# EAGLE design LEGOduino (EAGLE 9.5.2)

## Sheet 1 of 2
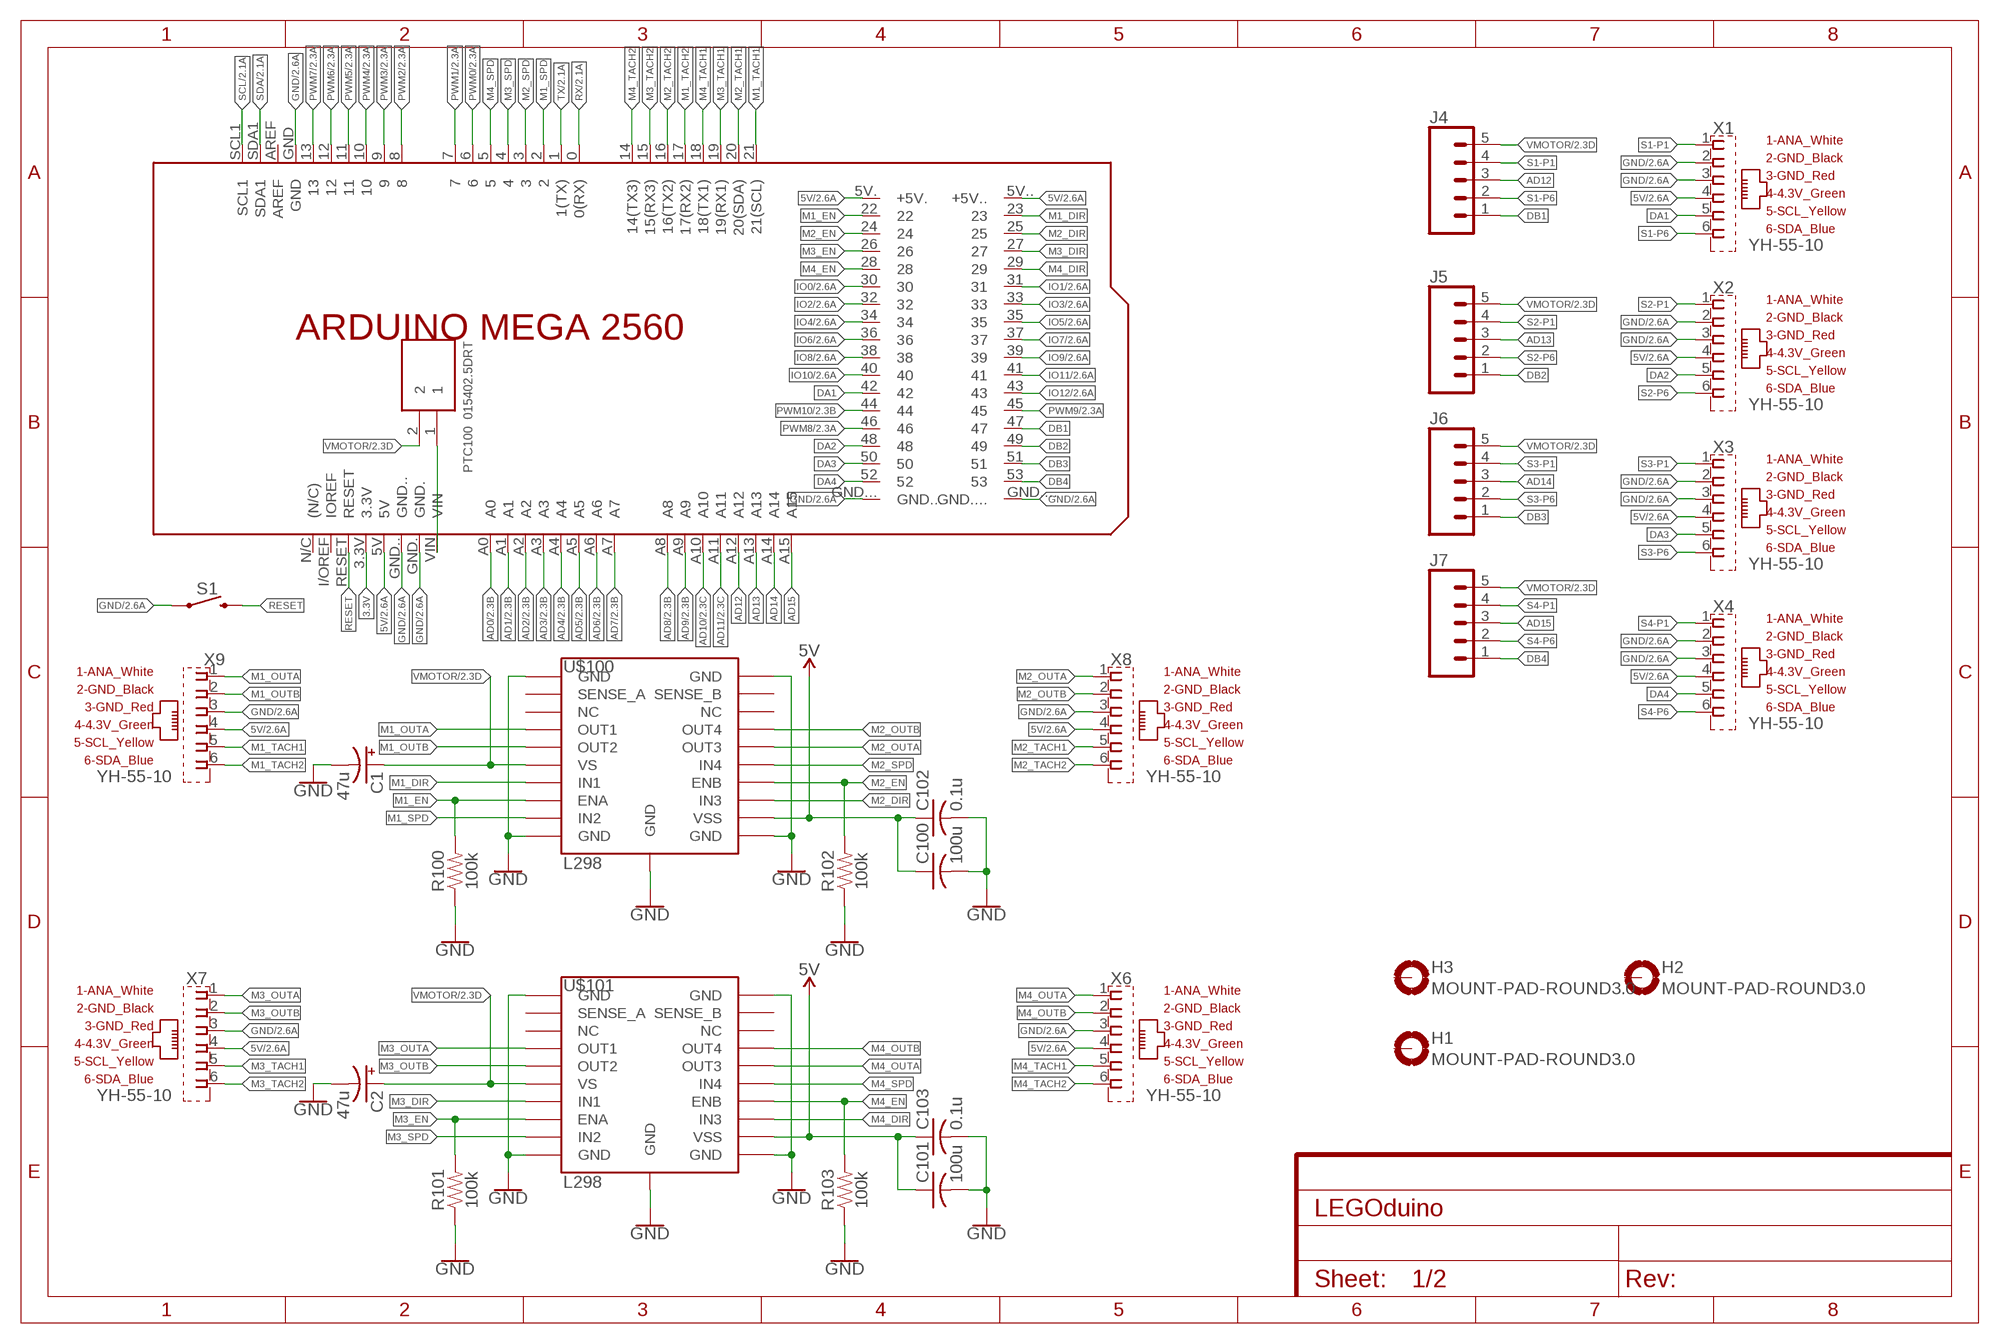
[diagram p0: schematic, sheet 1]

### Parts
C1  47u  C-POL-US_ECAP-8.5MM  [CAPAE830X1050N]
C2  47u  C-POL-US_ECAP-8.5MM  [CAPAE830X1050N]
C100  100u  C-USC0805K  [C0805K]
C101  100u  C-USC0805K  [C0805K]
C102  0.1u  C-USC0805K  [C0805K]
C103  0.1u  C-USC0805K  [C0805K]
H1  MOUNT-PAD-ROUND3.0  [3,0-PAD]
H2  MOUNT-PAD-ROUND3.0  [3,0-PAD]
H3  MOUNT-PAD-ROUND3.0  [3,0-PAD]
J4  CONN_05  [1X05]
J5  CONN_05  [1X05]
J6  CONN_05  [1X05]
J7  CONN_05  [1X05]
PCB100  ARDUINO_MEGA2560  [ARDUINO_MEGA2560]
PTC100  015402.5DRT  [FUSM9750X381N]
R100  100k  RESISTOR0805  [0805]
R101  100k  RESISTOR0805  [0805]
R102  100k  RESISTOR0805  [0805]
R103  100k  RESISTOR0805  [0805]
S1  MOMENTARY-SWITCH-SPST-SMD-5.2MM  [TACTILE_SWITCH_SMD_5.2MM]
U$100  L298  L298_SMD_W_PAD  [POWERSO20_L298_PAD]
U$101  L298  L298_SMD_W_PAD  [POWERSO20_L298_PAD]
X1  YH-55-10  [YH-55-10]
X2  YH-55-10  [YH-55-10]
X3  YH-55-10  [YH-55-10]
X4  YH-55-10  [YH-55-10]
X6  YH-55-10  [YH-55-10]
X7  YH-55-10  [YH-55-10]
X8  YH-55-10  [YH-55-10]
X9  YH-55-10  [YH-55-10]

### Nets
3.3V: PCB100.3.3V
5V: C100.1 C101.1 C102.1 C103.1 PCB100.5V PCB100.5V.(+5V.) PCB100.5V..(+5V..) U$100.12(VSS) U$101.12(VSS) X1.4(4_4.3V_GREEN) X2.4(4_4.3V_GREEN) X3.4(4_4.3V_GREEN) X4.4(4_4.3V_GREEN) X6.4(4_4.3V_GREEN) X7.4(4_4.3V_GREEN) X8.4(4_4.3V_GREEN) X9.4(4_4.3V_GREEN) ; also sheet 2
AD0: PCB100.A0 ; also sheet 2
AD1: PCB100.A1 ; also sheet 2
AD2: PCB100.A2 ; also sheet 2
AD3: PCB100.A3 ; also sheet 2
AD4: PCB100.A4 ; also sheet 2
AD5: PCB100.A5 ; also sheet 2
AD6: PCB100.A6 ; also sheet 2
AD7: PCB100.A7 ; also sheet 2
AD8: PCB100.A8 ; also sheet 2
AD9: PCB100.A9 ; also sheet 2
AD10: PCB100.A10 ; also sheet 2
AD11: PCB100.A11 ; also sheet 2
AD12: J4.3 PCB100.A12
AD13: J5.3 PCB100.A13
AD14: J6.3 PCB100.A14
AD15: J7.3 PCB100.A15
DA1: PCB100.42 X1.5(5_SCL_YELLOW)
DA2: PCB100.48 X2.5(5_SCL_YELLOW)
DA3: PCB100.50 X3.5(5_SCL_YELLOW)
DA4: PCB100.52 X4.5(5_SCL_YELLOW)
DB1: J4.1 PCB100.47
DB2: J5.1 PCB100.49
DB3: J6.1 PCB100.51
DB4: J7.1 PCB100.53
GND: C1.2(-) C2.2(-) C100.2 C101.2 C102.2 C103.2 PCB100.GND PCB100.GND. PCB100.GND.. PCB100.GND... PCB100.GND.... R100.1 R101.1 R102.1 R103.1 S1.1 U$100.1(GND) U$100.10(GND) U$100.11(GND) U$100.20(GND) U$100.PAD(GND) U$101.1(GND) U$101.10(GND) U$101.11(GND) U$101.20(GND) U$101.PAD(GND) X1.2(2_GND_BLACK) X1.3(3_GND_RED) X2.2(2_GND_BLACK) X2.3(3_GND_RED) X3.2(2_GND_BLACK) X3.3(3_GND_RED) X4.2(2_GND_BLACK) X4.3(3_GND_RED) X6.3(3_GND_RED) X7.3(3_GND_RED) X8.3(3_GND_RED) X9.3(3_GND_RED) ; also sheet 2
IO0: PCB100.30 ; also sheet 2
IO1: PCB100.31 ; also sheet 2
IO2: PCB100.32 ; also sheet 2
IO3: PCB100.33 ; also sheet 2
IO4: PCB100.34 ; also sheet 2
IO5: PCB100.35 ; also sheet 2
IO6: PCB100.36 ; also sheet 2
IO7: PCB100.37 ; also sheet 2
IO8: PCB100.38 ; also sheet 2
IO9: PCB100.39 ; also sheet 2
IO10: PCB100.40 ; also sheet 2
IO11: PCB100.41 ; also sheet 2
IO12: PCB100.43 ; also sheet 2
M1_DIR: PCB100.23 U$100.7(IN1)
M1_EN: PCB100.22 R100.2 U$100.8(ENA)
M1_OUTA: U$100.4(OUT1) X9.1(1_ANA_WHITE)
M1_OUTB: U$100.5(OUT2) X9.2(2_GND_BLACK)
M1_SPD: PCB100.2 U$100.9(IN2)
M1_TACH1: PCB100.21(21(SCL)) X9.5(5_SCL_YELLOW)
M1_TACH2: PCB100.17(17(RX2)) X9.6(6_SDA_BLUE)
M2_DIR: PCB100.25 U$100.13(IN3)
M2_EN: PCB100.24 R102.2 U$100.14(ENB)
M2_OUTA: U$100.16(OUT3) X8.1(1_ANA_WHITE)
M2_OUTB: U$100.17(OUT4) X8.2(2_GND_BLACK)
M2_SPD: PCB100.3 U$100.15(IN4)
M2_TACH1: PCB100.20(20(SDA)) X8.5(5_SCL_YELLOW)
M2_TACH2: PCB100.16(16(TX2)) X8.6(6_SDA_BLUE)
M3_DIR: PCB100.27 U$101.7(IN1)
M3_EN: PCB100.26 R101.2 U$101.8(ENA)
M3_OUTA: U$101.4(OUT1) X7.1(1_ANA_WHITE)
M3_OUTB: U$101.5(OUT2) X7.2(2_GND_BLACK)
M3_SPD: PCB100.4 U$101.9(IN2)
M3_TACH1: PCB100.19(19(RX1)) X7.5(5_SCL_YELLOW)
M3_TACH2: PCB100.15(15(RX3)) X7.6(6_SDA_BLUE)
M4_DIR: PCB100.29 U$101.13(IN3)
M4_EN: PCB100.28 R103.2 U$101.14(ENB)
M4_OUTA: U$101.16(OUT3) X6.1(1_ANA_WHITE)
M4_OUTB: U$101.17(OUT4) X6.2(2_GND_BLACK)
M4_SPD: PCB100.5 U$101.15(IN4)
M4_TACH1: PCB100.18(18(TX1)) X6.5(5_SCL_YELLOW)
M4_TACH2: PCB100.14(14(TX3)) X6.6(6_SDA_BLUE)
N$19: PCB100.VIN PTC100.1
PWM0: PCB100.6 ; also sheet 2
PWM1: PCB100.7 ; also sheet 2
PWM2: PCB100.8 ; also sheet 2
PWM3: PCB100.9 ; also sheet 2
PWM4: PCB100.10 ; also sheet 2
PWM5: PCB100.11 ; also sheet 2
PWM6: PCB100.12 ; also sheet 2
PWM7: PCB100.13 ; also sheet 2
PWM8: PCB100.46 ; also sheet 2
PWM9: PCB100.45 ; also sheet 2
PWM10: PCB100.44 ; also sheet 2
RESET: PCB100.RESET S1.3
RX: PCB100.0(0(RX)) ; also sheet 2
S1-P1: J4.4 X1.1(1_ANA_WHITE)
S1-P6: J4.2 X1.6(6_SDA_BLUE)
S2-P1: J5.4 X2.1(1_ANA_WHITE)
S2-P6: J5.2 X2.6(6_SDA_BLUE)
S3-P1: J6.4 X3.1(1_ANA_WHITE)
S3-P6: J6.2 X3.6(6_SDA_BLUE)
S4-P1: J7.4 X4.1(1_ANA_WHITE)
S4-P6: J7.2 X4.6(6_SDA_BLUE)
SCL: PCB100.SCL1 ; also sheet 2
SDA: PCB100.SDA1 ; also sheet 2
TX: PCB100.1(1(TX)) ; also sheet 2
VMOTOR: C1.1(+) C2.1(+) J4.5 J5.5 J6.5 J7.5 PTC100.2 U$100.6(VS) U$101.6(VS) ; also sheet 2
Unconnected: H1.B3,0(MOUNT) H2.B3,0(MOUNT) H3.B3,0(MOUNT) PCB100.AREF PCB100.I/OREF(IOREF) PCB100.N/C((N/C)) U$100.2(SENSE_A) U$100.3(NC) U$100.18(NC) U$100.19(SENSE_B) U$101.2(SENSE_A) U$101.3(NC) U$101.18(NC) U$101.19(SENSE_B)

## Sheet 2 of 2
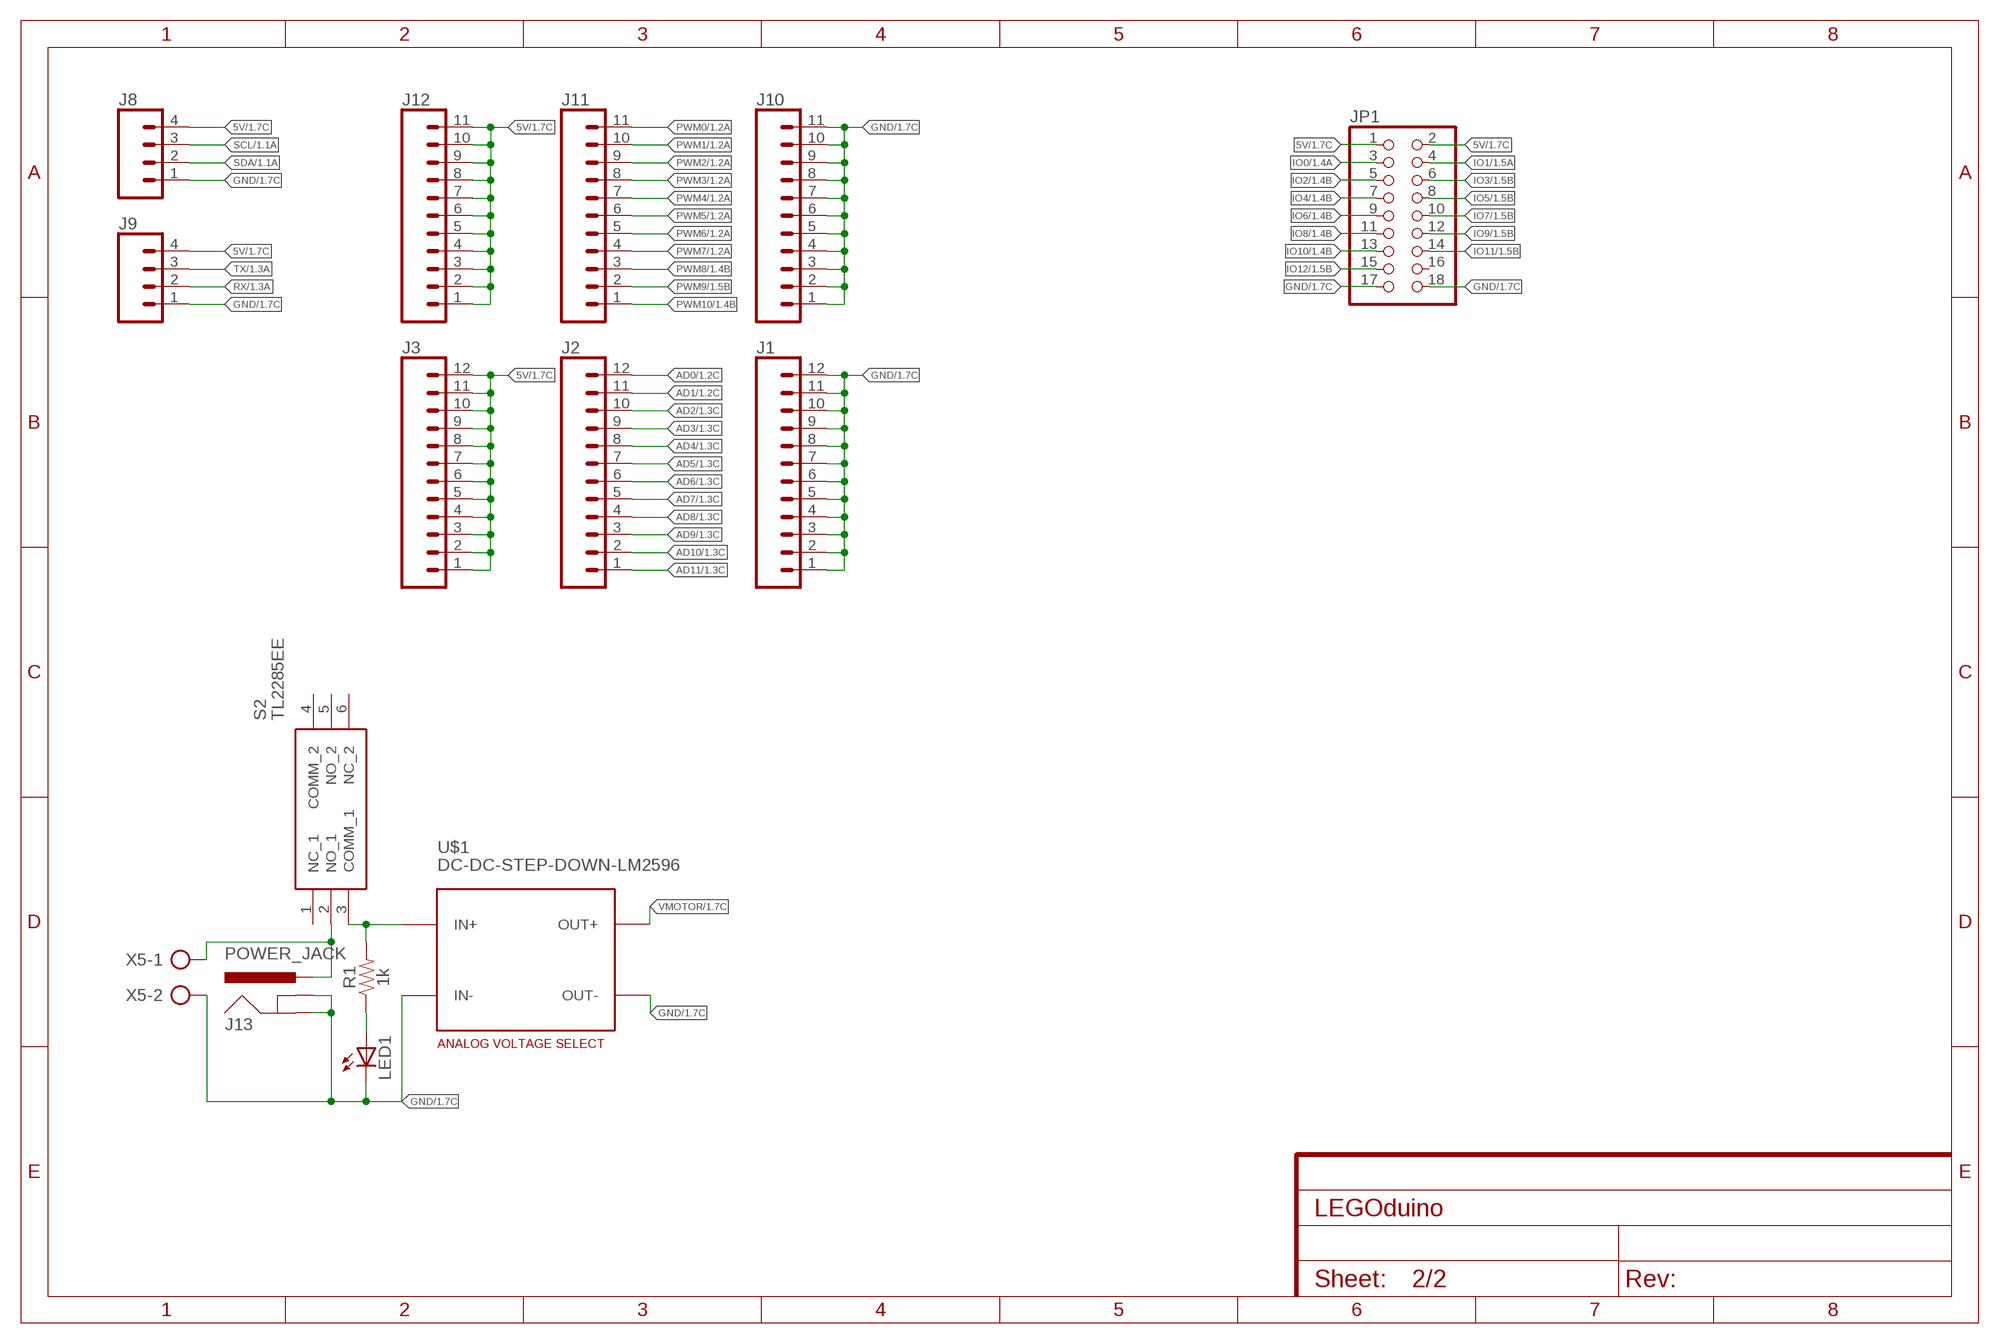
[diagram p1: schematic, sheet 2]

### Parts
J1  CONN_12  [1X12]
J2  CONN_12  [1X12]
J3  CONN_12  [1X12]
J8  CONN_04  [1X04]
J9  CONN_04  [1X04]
J10  CONN_11  [1X11]
J11  CONN_11  [1X11]
J12  CONN_11  [1X11]
J13  POWER_JACK  [POWER_JACK_PTH]
JP1  PINHD-2X9  [2X09]
LED1  LEDCHIP-LED0805  [CHIP-LED0805]
R1  1k  RESISTOR0805  [0805]
S2  TL2285EE  [TL2285EE]
U$1  DC-DC-STEP-DOWN-LM2596  [DC-DC-STEP-DOWN-LM2596]
X5  AK500/2-H  [AK500/2-H]

### Nets
5V: J3.1 J3.2 J3.3 J3.4 J3.5 J3.6 J3.7 J3.8 J3.9 J3.10 J3.11 J3.12 J8.4 J9.4 J12.1 J12.2 J12.3 J12.4 J12.5 J12.6 J12.7 J12.8 J12.9 J12.10 J12.11 JP1.1 JP1.2 ; also sheet 1
AD0: J2.12 ; also sheet 1
AD1: J2.11 ; also sheet 1
AD2: J2.10 ; also sheet 1
AD3: J2.9 ; also sheet 1
AD4: J2.8 ; also sheet 1
AD5: J2.7 ; also sheet 1
AD6: J2.6 ; also sheet 1
AD7: J2.5 ; also sheet 1
AD8: J2.4 ; also sheet 1
AD9: J2.3 ; also sheet 1
AD10: J2.2 ; also sheet 1
AD11: J2.1 ; also sheet 1
GND: J1.1 J1.2 J1.3 J1.4 J1.5 J1.6 J1.7 J1.8 J1.9 J1.10 J1.11 J1.12 J8.1 J9.1 J10.1 J10.2 J10.3 J10.4 J10.5 J10.6 J10.7 J10.8 J10.9 J10.10 J10.11 J13.GND J13.GNDBREAK JP1.17 JP1.18 LED1.C U$1.IN- U$1.OUT- X5.2 ; also sheet 1
IO0: JP1.3 ; also sheet 1
IO1: JP1.4 ; also sheet 1
IO2: JP1.5 ; also sheet 1
IO3: JP1.6 ; also sheet 1
IO4: JP1.7 ; also sheet 1
IO5: JP1.8 ; also sheet 1
IO6: JP1.9 ; also sheet 1
IO7: JP1.10 ; also sheet 1
IO8: JP1.11 ; also sheet 1
IO9: JP1.12 ; also sheet 1
IO10: JP1.13 ; also sheet 1
IO11: JP1.14 ; also sheet 1
IO12: JP1.15 ; also sheet 1
N$97: R1.2 S2.3(COMM_1) U$1.IN+
N$98: LED1.A R1.1
N$100: J13.PWR S2.2(NO_1) X5.1
PWM0: J11.11 ; also sheet 1
PWM1: J11.10 ; also sheet 1
PWM2: J11.9 ; also sheet 1
PWM3: J11.8 ; also sheet 1
PWM4: J11.7 ; also sheet 1
PWM5: J11.6 ; also sheet 1
PWM6: J11.5 ; also sheet 1
PWM7: J11.4 ; also sheet 1
PWM8: J11.3 ; also sheet 1
PWM9: J11.2 ; also sheet 1
PWM10: J11.1 ; also sheet 1
RX: J9.2 ; also sheet 1
SCL: J8.3 ; also sheet 1
SDA: J8.2 ; also sheet 1
TX: J9.3 ; also sheet 1
VMOTOR: U$1.OUT+ ; also sheet 1
Unconnected: JP1.16 S2.1(NC_1) S2.4(COMM_2) S2.5(NO_2) S2.6(NC_2)

### Notes on the sheet
- ANALOG VOLTAGE SELECT

## Library data of the parts
C1 C2 = Capacitor:C-POL-US: Capacitor Polarised - ANSI; CATEGORY: Capacitor
C100-C103 = adafruit:C-US: CAPACITOR, American symbol
H1-H3 = holes:MOUNT-PAD-ROUND: MOUNTING PAD, round
J1-J3 = SparkFun-Connectors:CONN_12: Multi connection point. Often used as Generic Header-pin footprint for 0.1 inch spaced/style header connections On any of the 0.1 inch spaced packages, you can populate with these: Break Away Headers - Straight <https://www.sparkfun.com/products/116> (PRT-00116) Break Away Male Headers - Right Angle <https://www.sparkfun.com/products/553> (PRT-00553) Female Headers <https://www.sparkfun.com/products/115> (PRT-00115) Break Away Headers - Machine Pin <https://www.sparkfun.com/products/117> (PRT-00117) Break Away Female Headers - Swiss Machine Pin <https://www.sparkfun.com/products/743> (PRT-00743) For SCREWTERMINALS and SPRING TERMINALS visit here: Screw Terimnals on SparkFun.com <https://www.sparkfun.com/search/results?term=Screw+Terminals> (5mm/3.5mm/2.54mm spacing) This device is also useful as a general connection point to wire up your design to another part of your project. Our various solder wires solder well into these plated through hole pads. Hook-Up Wire - Assortment (Stranded, 22 AWG) <https://www.sparkfun.com/products/11375> (PRT-11375) Hook-Up Wire - Assortment (Solid Core, 22 AWG) <https://www.sparkfun.com/products/11367> (PRT-11367) View the entire wire category on our website here <https://www.sparkfun.com/categories/141> Special notes: Molex polarized connector foot print use with SKU : PRT-08231 with associated crimp pins and housings. 1MM SMD Version SKU: PRT-10208 NOTES ON THE VARIANTS LOCK and LOCK_LONGPADS... This footprint was designed to help hold the alignment of a through-hole component (i.e. 6-pin header) while soldering it into place. You may notice that each hole has been shifted either up or down by 0.005 of an inch from it's more standard position (which is a perfectly straight line). This slight alteration caused the pins (the squares in the middle) to touch the edges of the holes. Because they are alternating, it causes a "brace" to hold the component in place. 0.005 has proven to be the perfect amount of "off-center" position when using our standard breakaway headers. Although looks a little odd when you look at the bare footprint, once you have a header in there, the alteration is very hard to notice. Also,if you push a header all the way into place, it is covered up entirely on the bottom side.
J4-J7 = SparkFun-Connectors:CONN_05: Multi connection point. Often used as Generic Header-pin footprint for 0.1 inch spaced/style header connections On any of the 0.1 inch spaced packages, you can populate with these: Break Away Headers - Straight <https://www.sparkfun.com/products/116> (PRT-00116) Break Away Male Headers - Right Angle <https://www.sparkfun.com/products/553> (PRT-00553) Female Headers <https://www.sparkfun.com/products/115> (PRT-00115) Break Away Headers - Machine Pin <https://www.sparkfun.com/products/117> (PRT-00117) Break Away Female Headers - Swiss Machine Pin <https://www.sparkfun.com/products/743> (PRT-00743) For SCREWTERMINALS and SPRING TERMINALS visit here: Screw Terimnals on SparkFun.com <https://www.sparkfun.com/search/results?term=Screw+Terminals> (5mm/3.5mm/2.54mm spacing) This device is also useful as a general connection point to wire up your design to another part of your project. Our various solder wires solder well into these plated through hole pads. Hook-Up Wire - Assortment (Stranded, 22 AWG) <https://www.sparkfun.com/products/11375> (PRT-11375) Hook-Up Wire - Assortment (Solid Core, 22 AWG) <https://www.sparkfun.com/products/11367> (PRT-11367) View the entire wire category on our website here <https://www.sparkfun.com/categories/141> Special notes: Molex polarized connector foot print use with SKU : PRT-08231 with associated crimp pins and housings. 1MM SMD Version SKU: PRT-10208
J8 J9 = SparkFun-Connectors:CONN_04: Multi connection point. Often used as Generic Header-pin footprint for 0.1 inch spaced/style header connections On any of the 0.1 inch spaced packages, you can populate with these: Break Away Headers - Straight <https://www.sparkfun.com/products/116> (PRT-00116) Break Away Male Headers - Right Angle <https://www.sparkfun.com/products/553> (PRT-00553) Female Headers <https://www.sparkfun.com/products/115> (PRT-00115) Break Away Headers - Machine Pin <https://www.sparkfun.com/products/117> (PRT-00117) Break Away Female Headers - Swiss Machine Pin <https://www.sparkfun.com/products/743> (PRT-00743) For SCREWTERMINALS and SPRING TERMINALS visit here: Screw Terimnals on SparkFun.com <https://www.sparkfun.com/search/results?term=Screw+Terminals> (5mm/3.5mm/2.54mm spacing) This device is also useful as a general connection point to wire up your design to another part of your project. Our various solder wires solder well into these plated through hole pads. Hook-Up Wire - Assortment (Stranded, 22 AWG) <https://www.sparkfun.com/products/11375> (PRT-11375) Hook-Up Wire - Assortment (Solid Core, 22 AWG) <https://www.sparkfun.com/products/11367> (PRT-11367) View the entire wire category on our website here <https://www.sparkfun.com/categories/141> Special notes: Molex polarized connector foot print use with SKU : PRT-08231 with associated crimp pins and housings. 1MM SMD Version SKU: PRT-10208; PROD_ID: CONN-09696
J10-J12 = SparkFun-Connectors:CONN_11: Multi connection point. Often used as Generic Header-pin footprint for 0.1 inch spaced/style header connections On any of the 0.1 inch spaced packages, you can populate with these: Break Away Headers - Straight <https://www.sparkfun.com/products/116> (PRT-00116) Break Away Male Headers - Right Angle <https://www.sparkfun.com/products/553> (PRT-00553) Female Headers <https://www.sparkfun.com/products/115> (PRT-00115) Break Away Headers - Machine Pin <https://www.sparkfun.com/products/117> (PRT-00117) Break Away Female Headers - Swiss Machine Pin <https://www.sparkfun.com/products/743> (PRT-00743) For SCREWTERMINALS and SPRING TERMINALS visit here: Screw Terimnals on SparkFun.com <https://www.sparkfun.com/search/results?term=Screw+Terminals> (5mm/3.5mm/2.54mm spacing) This device is also useful as a general connection point to wire up your design to another part of your project. Our various solder wires solder well into these plated through hole pads. Hook-Up Wire - Assortment (Stranded, 22 AWG) <https://www.sparkfun.com/products/11375> (PRT-11375) Hook-Up Wire - Assortment (Solid Core, 22 AWG) <https://www.sparkfun.com/products/11367> (PRT-11367) View the entire wire category on our website here <https://www.sparkfun.com/categories/141>
J13 = SparkFun-Connectors:POWER_JACK: Power Jack Connector This is the standard 5.5mm barrel jack for power. The PTH is the most common, proven, reliable, footprint. The Slot footprint only works if the mill layer is transmitted to the PCB fab house so be warned. Here are the connectors we sell at SparkFun: DC Barrel Power Jack/Connector <https://www.sparkfun.com/products/119> (PRT-00119) DC Barrel Power Jack/Connector (SMD) <https://www.sparkfun.com/products/12748> (PRT-12748) DC Barrel Jack Adapter - Breadboard Compatible <https://www.sparkfun.com/products/10811> (PRT-10811) It is used on this SparkFun product (and many, many others): SparkFun RedBoard - Programmed with Arduino <https://www.sparkfun.com/products/12757> (DEV-12757) Also, if you need a mating power supply or connector, please check these out: Wall Adapter Power Supply - 9VDC 650mA <https://www.sparkfun.com/products/298> (TOL-00298) DC Barrel Jack Adapter - Male <https://www.sparkfun.com/products/10287> (PRT-10287); PROD_ID: CONN-08197
JP1 = pinhead:PINHD-2X9: PIN HEADER
LED1 = adafruit:LED: LED OSRAM: - CHIPLED LG R971, LG N971, LY N971, LG Q971, LY Q971, LO R971, LY R971 LH N974, LH R974 LS Q976, LO Q976, LY Q976 LO Q996 - Hyper CHIPLED LW Q18S LB Q993, LB Q99A, LB R99A - SideLED LS A670, LO A670, LY A670, LG A670, LP A670 LB A673, LV A673, LT A673, LW A673 LH A674 LY A675 LS A676, LA A676, LO A676, LY A676, LW A676 LS A679, LY A679, LG A679 - Hyper Micro SIDELED® LS Y876, LA Y876, LO Y876, LY Y876 LT Y87S - SmartLED LW L88C, LW L88S LB L89C, LB L89S, LG L890 LS L89K, LO L89K, LY L89K LS L896, LA L896, LO L896, LY L896 - TOPLED LS T670, LO T670, LY T670, LG T670, LP T670 LSG T670, LSP T670, LSY T670, LOP T670, LYG T670 LG T671, LOG T671, LSG T671 LB T673, LV T673, LT T673, LW T673 LH T674 LS T676, LA T676, LO T676, LY T676, LB T676, LH T676, LSB T676, LW T676 LB T67C, LV T67C, LT T67C, LS T67K, LO T67K, LY T67K, LW E67C LS E67B, LA E67B, LO E67B, LY E67B, LB E67C, LV E67C, LT E67C LW T67C LS T679, LY T679, LG T679 LS T770, LO T770, LY T770, LG T770, LP T770 LB T773, LV T773, LT T773, LW T773 LH T774 LS E675, LA E675, LY E675, LS T675 LS T776, LA T776, LO T776, LY T776, LB T776 LHGB T686 LT T68C, LB T68C - Hyper Mini TOPLED® LB M676 - Mini TOPLED Santana® LG M470 LS M47K, LO M47K, LY M47K Source: http://www.osram.convergy.de/
PCB100 = Mega:ARDUINO_MEGA2560: Device for representing an Arduino Mega 2560 board with a footprint in an EAGLE design. Created by Dave Young for Element14. More EAGLE documentation at: http://www.element14.com/community/community/knode/cadsoft_eagle
PTC100 = 015402.5DRT:015402.5DRT: Littelfuse 2.5A T Non-Resettable Surface Mount Fuse, 125 V Source: Datasheet <https://www.littelfuse.com/~/media/electronics/datasheets/fuses/littelfuse_fuse_154_154t_154l_154tl_datasheet.pdf.pdf>; ALLIED_NUMBER: 70519127; ALLIED_PRICE-STOCK: https://www.alliedelec.com/littelfuse-015402-5drt/70519127/; DESCRIPTION: Littelfuse 2.5A T Non-Resettable Surface Mount Fuse, 125 V; HEIGHT: 3.81mm; MANUFACTURER_NAME: LITTELFUSE; MANUFACTURER_PART_NUMBER: 015402.5DRT; MOUSER_PART_NUMBER: 576-015402.5DRT; MOUSER_PRICE-STOCK: https://www.mouser.com/Search/Refine.aspx?Keyword=576-015402.5DRT; RS_PART_NUMBER: 7382860P; RS_PRICE-STOCK: http://uk.rs-online.com/web/p/products/7382860P
R1 R100-R103 = SparkFun-Resistors:RESISTOR: Generic Resistor Package
S1 = SparkFun-Switches:MOMENTARY-SWITCH-SPST: Momentary Switch (Pushbutton) - SPST Normally-open (NO) SPST momentary switches (buttons, pushbuttons). Variants PTH-12MM - 12mm square, through-hole Momentary Pushbutton Switch - 12mm Square <https://www.sparkfun.com/products/9190> (COM-09190) PTH-6.0MM, PTH-6.0MM-KIT - 6.0mm square, through-hole Mini Pushbutton Switch <https://www.sparkfun.com/products/97> (COM-00097) KIT package intended for soldering kit's - only one side of pads' copper is exposed. PTH-RIGHT-ANGLE-KIT - Right-angle, through-hole Right Angle Tactile Button <https://www.sparkfun.com/products/10791> - Used on SparkFun BigTime Watch Kit <https://www.sparkfun.com/products/11734> SMD-12MM - 12mm square, surface-mount Tactile Button - SMD (12mm) <https://www.sparkfun.com/products/12993> (COM-12993) Used on SparkFun PicoBoard <https://www.sparkfun.com/products/11888> SMD-4.5MM - 4.5mm Square Trackball Switch Used on SparkFun Blackberry Trackballer Breakout <https://www.sparkfun.com/products/13169> SMD-4.6MMX2.8MM - 4.60mm x 2.80mm, surface mount Used on SparkFun SAMD21 Mini Breakout <https://www.sparkfun.com/products/13664> SMD-5.2MM, SMD-5.2-REDUNDANT - 5.2mm square, surface-mount Mini Pushbutton Switch - SMD <https://www.sparkfun.com/products/8720> (COM-08720) Used on Arduino Pro Mini <https://www.sparkfun.com/products/11114> REDUNDANT package connects both switch circuits together SMD-6.0X3.5MM - 6.0 x 3.5mm, surface mount Momentary Reset Switch SMD <https://www.sparkfun.com/products/8229> (COM-08229) SMD-6.2MM-TALL - 6.2mm square, surface mount Tactile Button - SMD (6mm) <https://www.sparkfun.com/products/12992> Used on SparkFun Digital Sandbox <https://www.sparkfun.com/products/12651> SMD-RIGHT-ANGLE - Right-angle, surface mount Used on SparkFun Block for Intel® Edison - Arduino <https://www.sparkfun.com/products/13036>; PROD_ID: SWCH-08247; SF_SKU: COM-08720
S2 = TL2285EE:TL2285EE: Tactile Switches DPDT ALT ACT PC MNT Source: Datasheet <https://componentsearchengine.com/Datasheets/1/TL2285EE.pdf>; DESCRIPTION: Tactile Switches DPDT ALT ACT PC MNT; HEIGHT: 13mm; MANUFACTURER_NAME: E-Switch; MANUFACTURER_PART_NUMBER: TL2285EE; MOUSER_PART_NUMBER: 612-TL2285EE
U$1 = diy-modules:DC-DC-STEP-DOWN-LM2596: DC/DC Step-Down Regulator based on LM2596-ADJ chip LM2596 datasheet available here: http://www.ti.com/lit/ds/symlink/lm2596.pdf Click here to find device on ebay.com <http://www.ebay.com/sch/lm2596+power+regulator>
U$100 U$101 = SparkFun-IC-Special-Function:L298_SMD_W_PAD: Full-bridge power driver IC This device uses the ground pad under the IC; PROD_ID: IC-09133
X1-X4 X6-X9 = Dexter_Industries_Eagle_Library_Female_Sockets:YH-55-10: RJ11 6 connects Source:Dexter Industries LEGO MINDSTORMS NXT Female Adapter; OC_FARNELL: unknown; OC_NEWARK: unknown
X5 = con-ptr500:AK500/2-H: CONNECTOR Aug. 2004 / PTR Meßtechnik: Die Bezeichnung der Serie AK505 wurde geändert. Es handelt sich hierbei um AK500 in horizontaler Ausführung.; OC_FARNELL: unknown; OC_NEWARK: unknown

## Board
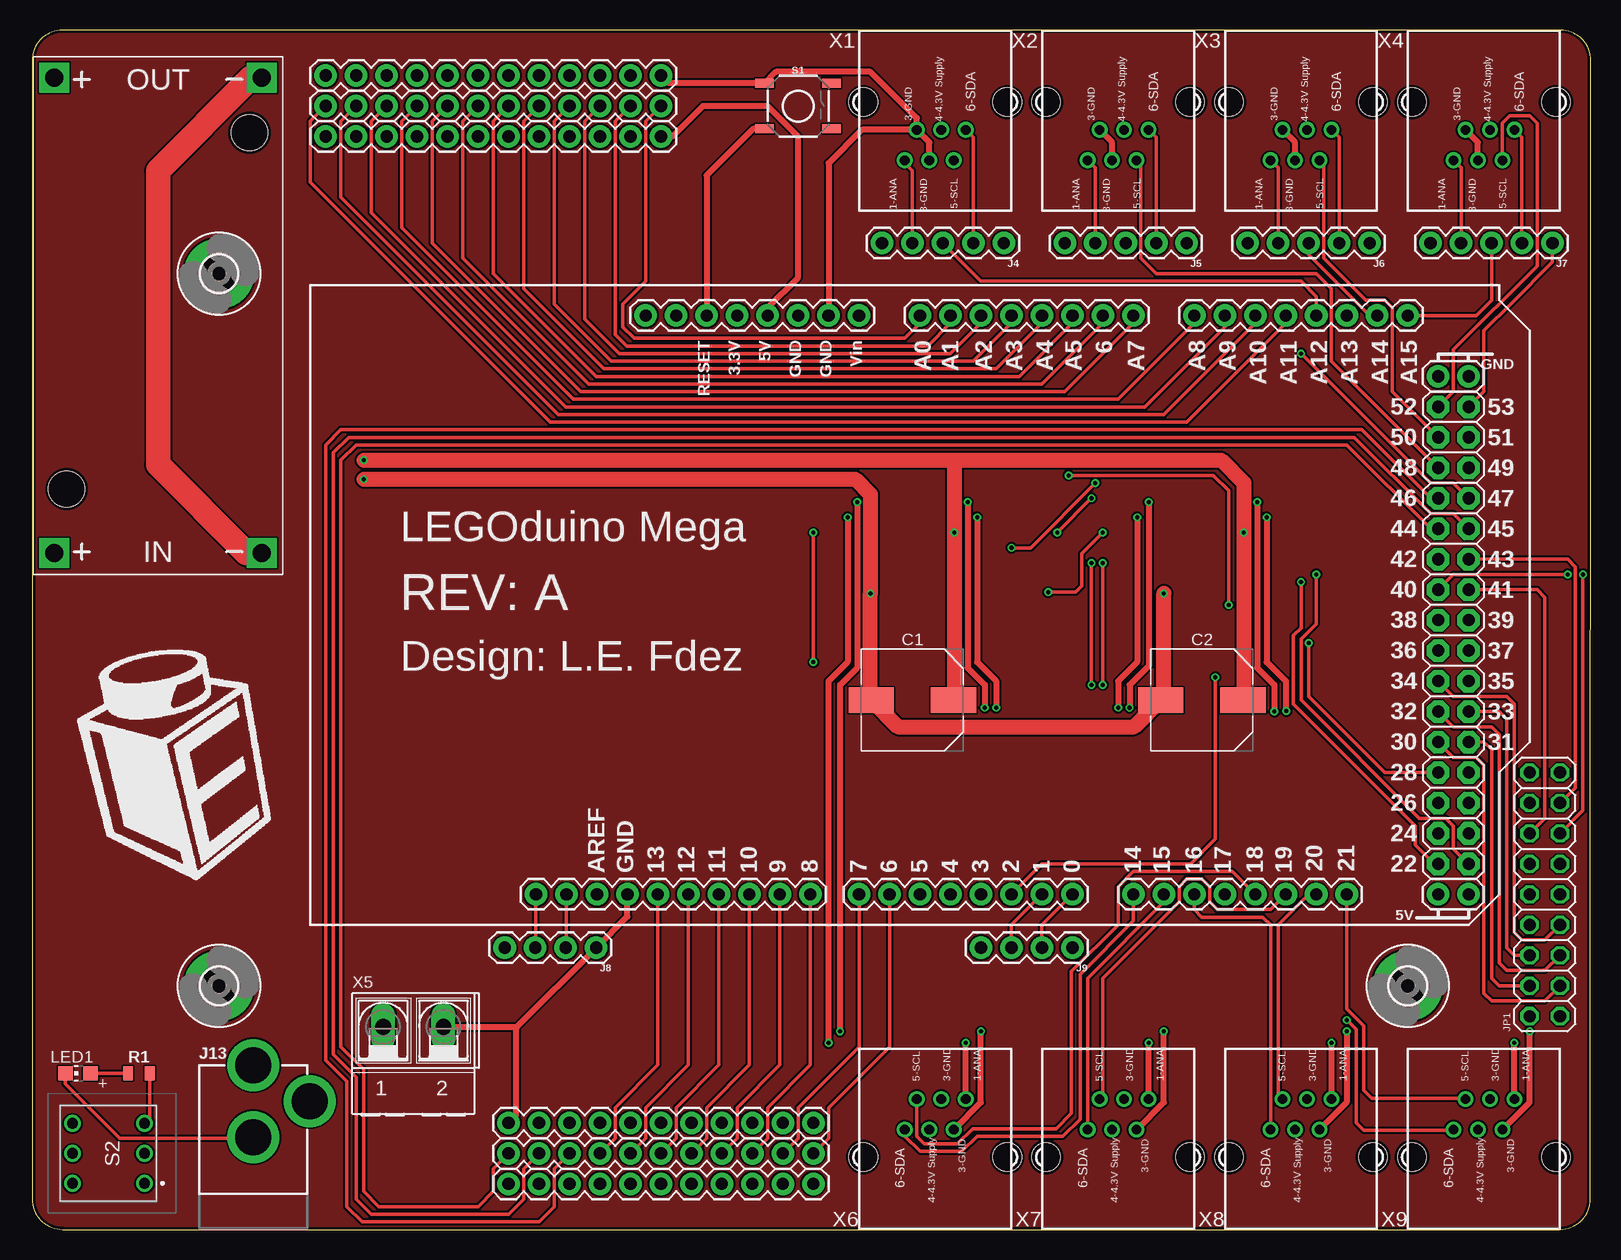
[diagram p2: board, top side]
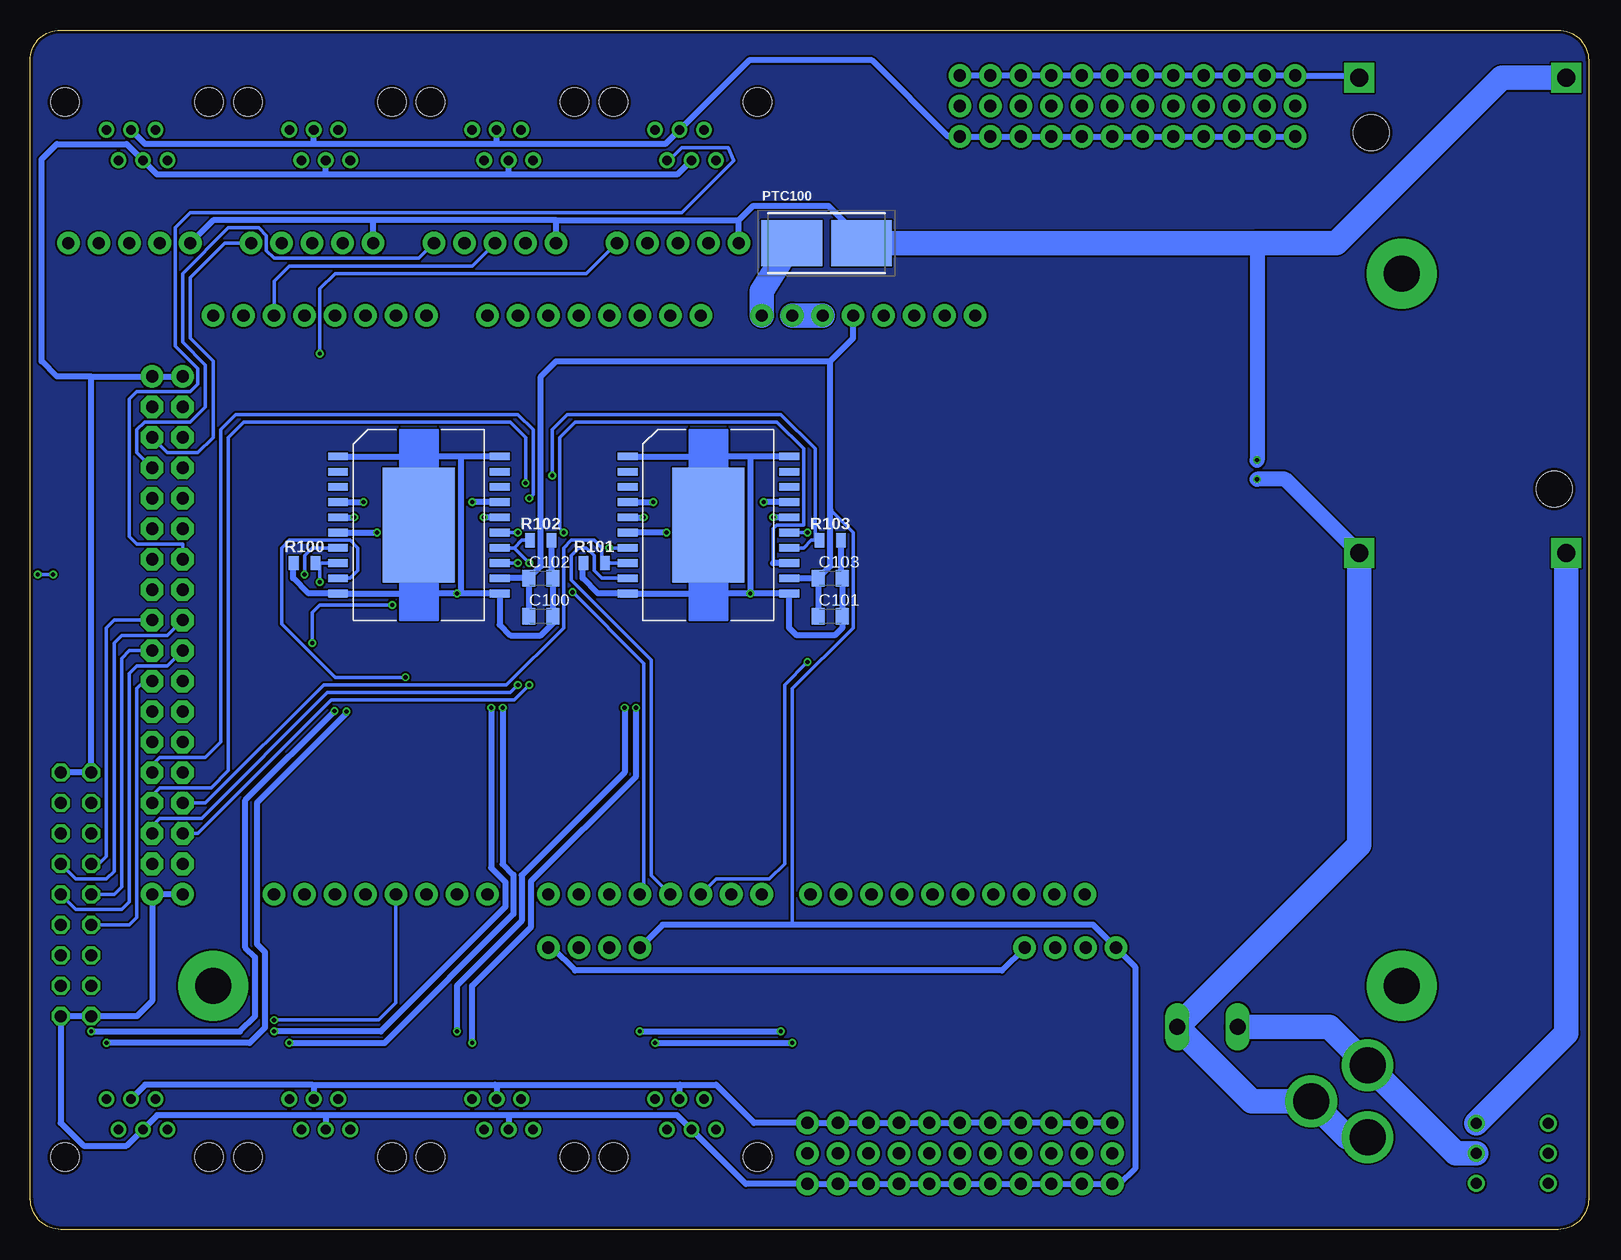
[diagram p3: board, bottom side, seen from below]

Size 129.88 x 100 mm. Coordinates in mm from the lower left corner, seen from the top.
Outline: 127.34,100 2.54,100 arc90 0,97.46 0,2.54 arc90 2.54,0 127.3,0 arc90 129.84,2.54 129.88,97.46 arc90 127.34,100
Copper layers (1*16): Top 0.035mm / dielectric 1.5mm / Bottom 0.035mm
Design rules "SeeedStudio_2layer_DRU_no_angle_20140221": minimum track width 6mil, minimum drill 12mil, track to track 6mil, track to pad 6mil, pad to pad 6mil, via to via 6mil, smd to smd 0mil, copper to edge 10mil, drill to drill 10mil, minimum pad ring 10mil, minimum via ring 6mil, stop-mask expansion 2mil, vias tented up to drill 100mil, thermal gap 10mil

### Footprints (pad centres in the part's own frame; a part is rotated, then mirrored left to right if it is on the bottom)
CAPAE830X1050N = smd 3.764 x 2.115: 1 -3.426,0; 2 3.426,0
C0805K = smd 1.1 x 1.4: 1 -1,0; 2 1,0
3,0-PAD = drill 3 pad 5.842: B3,0 0,0
1X12 = drill 1.016 pad 1.88: 1 0,0; 2 2.54,0; 3 5.08,0; 4 7.62,0; 5 10.16,0; 6 12.7,0; 7 15.24,0; 8 17.78,0; 9 20.32,0; 10 22.86,0; 11 25.4,0; 12 27.94,0
1X05 = drill 1.016 pad 1.88: 1 0,0; 2 2.54,0; 3 5.08,0; 4 7.62,0; 5 10.16,0
1X04 = drill 1.016 pad 1.88: 1 0,0; 2 2.54,0; 3 5.08,0; 4 7.62,0
1X11 = drill 1.016 pad 1.88: 1 0,0; 2 2.54,0; 3 5.08,0; 4 7.62,0; 5 10.16,0; 6 12.7,0; 7 15.24,0; 8 17.78,0; 9 20.32,0; 10 22.86,0; 11 25.4,0
POWER_JACK_PTH = drill 2.997 pad 4.318: GND 0,7.7; GNDBREAK 4.7,10.7; PWR 0,13.7
2X09 = drill 1.016 octagon: 1 -10.16,-1.27; 2 -10.16,1.27; 3 -7.62,-1.27; 4 -7.62,1.27; 5 -5.08,-1.27; 6 -5.08,1.27; 7 -2.54,-1.27; 8 -2.54,1.27; 9 0,-1.27; 10 0,1.27; 11 2.54,-1.27; 12 2.54,1.27; 13 5.08,-1.27; 14 5.08,1.27; 15 7.62,-1.27; 16 7.62,1.27; 17 10.16,-1.27; 18 10.16,1.27
CHIP-LED0805 = smd 1.2 x 1.2: A 0,-1.05; C 0,1.05
ARDUINO_MEGA2560 = drill 1.016 pad 1.88: 0 63.5,50.8; 1 60.96,50.8; 2 58.42,50.8; 3 55.88,50.8; 3.3V 35.56,2.54; 4 53.34,50.8; 5 50.8,50.8; 5V 38.1,2.54; 5V. 93.98,50.8; 5V.. 96.52,50.8; 6 48.26,50.8; 7 45.72,50.8; 8 41.656,50.8; 9 39.116,50.8; 10 36.576,50.8; 11 34.036,50.8; 12 31.496,50.8; 13 28.956,50.8; 14 68.58,50.8; 15 71.12,50.8; 16 73.66,50.8; 17 76.2,50.8; 18 78.74,50.8; 19 81.28,50.8; 20 83.82,50.8; 21 86.36,50.8; A0 50.8,2.54; A1 53.34,2.54; A2 55.88,2.54; A3 58.42,2.54; A4 60.96,2.54; A5 63.5,2.54; A6 66.04,2.54; A7 68.58,2.54; A8 73.66,2.54; A9 76.2,2.54; A10 78.74,2.54; A11 81.28,2.54; A12 83.82,2.54; A13 86.36,2.54; A14 88.9,2.54; A15 91.44,2.54; AREF 23.876,50.8; GND 26.416,50.8; GND. 43.18,2.54; GND.. 40.64,2.54; GND... 93.98,7.62; GND.... 96.52,7.62; I/OREF 30.48,2.54; N/C 27.94,2.54; RESET 33.02,2.54; SCL1 18.796,50.8; SDA1 21.336,50.8; VIN 45.72,2.54 | drill 1.016 pad 1.88 octagon: 22 93.98,48.26; 23 96.52,48.26; 24 93.98,45.72; 25 96.52,45.72; 26 93.98,43.18; 27 96.52,43.18; 28 93.98,40.64; 29 96.52,40.64; 30 93.98,38.1; 31 96.52,38.1; 32 93.98,35.56; 33 96.52,35.56; 34 93.98,33.02; 35 96.52,33.02; 36 93.98,30.48; 37 96.52,30.48; 38 93.98,27.94; 39 96.52,27.94; 40 93.98,25.4; 41 96.52,25.4; 42 93.98,22.86; 43 96.52,22.86; 44 93.98,20.32; 45 96.52,20.32; 46 93.98,17.78; 47 96.52,17.78; 48 93.98,15.24; 49 96.52,15.24; 50 93.98,12.7; 51 96.52,12.7; 52 93.98,10.16; 53 96.52,10.16
FUSM9750X381N = smd 5.05 x 3.85: 1 -2.9,0; 2 2.9,0
0805 = smd 0.8 x 1.2: 1 -0.9,0; 2 0.9,0
TACTILE_SWITCH_SMD_5.2MM = smd 1.524 x 0.762: 1 -2.794,1.905; 2 2.794,1.905; 3 -2.794,-1.905; 4 2.794,-1.905
TL2285EE = drill 0.9 pad 1.4: 1 -2.5,-3; 2 0,-3; 3 2.5,-3; 4 -2.5,3; 5 0,3; 6 2.5,3
DC-DC-STEP-DOWN-LM2596 = drill 1.5 pad 2.5 square: IN+ -19.812,8.636; IN- -19.812,-8.636; OUT+ 19.812,8.636; OUT- 19.812,-8.636 | hole 3: -14.478,7.62; 15.24,-7.62
POWERSO20_L298_PAD = smd 1.651 x 0.635: 1 -6.731,5.715; 2 -6.731,4.445; 3 -6.731,3.175; 4 -6.731,1.905; 5 -6.731,0.635; 6 -6.731,-0.635; 7 -6.731,-1.905; 8 -6.731,-3.175; 9 -6.731,-4.445; 10 -6.731,-5.715; 11 6.731,-5.715; 12 6.731,-4.445; 13 6.731,-3.175; 14 6.731,-1.905; 15 6.731,-0.635; 16 6.731,0.635; 17 6.731,1.905; 18 6.731,3.175; 19 6.731,4.445; 20 6.731,5.715 | smd 5.994 x 9.601: PAD 0,0
YH-55-10 = drill 0.8 pad 1.3: 1 2.54,4.84; 2 1.54,2.3; 3 0.5,4.84; 4 -0.5,2.3; 5 -1.54,4.84; 6 -2.54,2.3 | hole 2.36: -6,0; 6,0
AK500/2-H = drill 1.321 long: 1 -2.515,0; 2 2.515,0

### Placement (x,y rotation side)
C1  73.34,44.13 180 top
C2  97.47,44.13 180 top
C100  87.31,51.12 0 bottom
C101  63.18,51.12 0 bottom
C102  87.31,54.29 0 bottom
C103  63.18,54.29 0 bottom
H1  15.56,79.69 0 top
H2  15.56,20.32 0 top
H3  114.62,20.32 0 top
J1  52.39,96.2 180 top
J2  24.45,93.66 0 top
J3  52.39,91.12 180 top
J4  80.96,82.23 180 top
J5  96.2,82.23 180 top
J6  111.44,82.23 180 top
J7  126.68,82.23 180 top
J8  46.99,23.5 180 top
J9  86.68,23.5 180 top
J10  39.69,8.89 0 top
J11  39.69,6.35 0 top
J12  39.69,3.81 0 top
J13  18.41,0 0 top
JP1  126.05,27.94 90 top
LED1  3.81,13.02 90 top
PCB100  23.18,78.74 180 bottom
PTC100  63.5,82.23 0 bottom
R1  8.89,13.02 0 top
R100  107,55.56 0 bottom
R101  82.87,55.56 0 bottom
R102  87.31,57.47 180 bottom
R103  63.18,57.47 180 bottom
S1  63.82,93.66 0 top
S2  6.35,6.35 90 top
U$1  10.48,76.2 90 top
U$100  97.47,58.74 0 bottom
U$101  73.34,58.74 0 bottom
X1  75.25,93.98 180 top
X2  90.49,93.98 180 top
X3  105.73,93.98 180 top
X4  120.97,93.98 180 top
X5  31.75,16.89 0 top
X6  75.25,6.03 0 top
X7  90.49,6.03 0 top
X8  105.73,6.03 0 top
X9  120.97,6.03 0 top

### Tracks (layer width: path | path; a pad name or v marks a point on that pad's centre or on a via)
5V
  Top 0.508: PCB100.5V 61.28,76.83 63.82,79.38 63.82,91.12 61.28,93.66 55.88,93.66 53.34,91.12 J3.1
  Bottom 0.305: 66.36,25.4 66.36,45.09 61.28,50.16 61.28,58.1 63.18,60.01
  Bottom 0.508: J3.12 J3.11 J3.10 J3.9 J3.8 J3.7 J3.6 J3.5 J3.4 J3.3 J3.2 J3.1 53.34,91.12 59.69,97.47 69.95,97.47 X1.4 76.94,90.49 91.12,90.49 | PCB100.5V. PCB100.5V.. 119.7,19.05 120.97,17.78 JP1.2 JP1.1 127.32,8.89 125.41,6.99 121.81,6.99 X9.4 119.28,9.53 105.09,9.53 | 89.85,9.53 75.94,9.53 X6.4 70.23,3.81 J12.11 J12.10 J12.9 J12.8 J12.7 J12.6 J12.5 J12.4 J12.3 J12.2 J12.1 39.05,3.81 37.78,5.08 37.78,21.91 J8.4 41.27,25.4 66.36,25.4 77.15,25.4 J9.4 | 89.85,9.53 105.09,9.53 | 105.09,9.53 105.23,9.39 X8.4 | 89.85,9.53 89.99,9.39 X7.4 | C103.1 C101.1 | U$101.12 C103.1 | X4.4 120.28,90.49 106.36,90.49 | 91.12,90.49 106.36,90.49 | 106.36,90.49 106.23,90.62 X3.4 | 91.12,90.49 90.99,90.62 X2.4 | C102.1 C100.1 | C102.1 U$100.12 | C103.1 63.18,55.29 63.18,60.01 63.18,72.39 | 63.18,72.39 61.28,74.3 PCB100.5V | C102.1 87.31,55.29 87.31,71.12 86.04,72.39 63.18,72.39
AD0
  Top 0.305: PCB100.A0 73.98,75.56 72.71,74.3 50.17,74.3 49.21,75.25 49.21,77.15 51.12,79.06 51.12,92.39 J2.12
AD1
  Top 0.305: J2.11 48.58,92.39 48.58,74.61 49.53,73.66 74.61,73.66 76.52,75.56 PCB100.A1
AD2
  Top 0.305: PCB100.A2 79.06,75.56 76.52,73.03 48.9,73.03 46.04,75.88 46.04,92.39 J2.10
AD3
  Top 0.305: J2.9 43.5,92.39 43.5,77.15 48.26,72.39 78.42,72.39 81.6,75.56 PCB100.A3
AD4
  Top 0.305: PCB100.A4 84.14,75.56 80.33,71.75 47.63,71.75 40.96,78.42 40.96,92.39 J2.8
AD5
  Top 0.305: J2.7 38.42,92.39 38.42,79.69 46.99,71.12 82.23,71.12 86.68,75.56 PCB100.A5
AD6
  Top 0.305: PCB100.A6 89.22,75.56 84.14,70.48 46.36,70.48 35.88,80.96 35.88,92.39 J2.6
AD7
  Top 0.305: PCB100.A7 91.76,75.56 86.04,69.85 45.72,69.85 33.34,82.23 33.34,92.39 J2.5
AD8
  Top 0.305: PCB100.A8 96.84,75.56 90.49,69.22 45.08,69.22 30.8,83.5 30.8,92.39 J2.4
AD9
  Top 0.305: PCB100.A9 99.38,75.25 92.71,68.58 44.45,68.58 28.26,84.77 28.26,92.39 J2.3
AD10
  Top 0.305: PCB100.A10 101.92,75.56 94.3,67.94 43.81,67.94 25.72,86.04 25.72,92.39 J2.2
AD11
  Top 0.305: J2.1 23.18,92.39 23.18,87.31 43.18,67.31 96.2,67.31 104.46,75.56 PCB100.A11
AD12
  Top 0.305: PCB100.A12 107,77.79 105.73,79.06 79.06,79.06 J4.3
AD13
  Bottom 0.305: J5.3 93.03,80.33 108.27,80.33 109.54,79.06 PCB100.A13
AD14
  Top 0.305: J6.3 106.36,81.28 111.44,76.2 PCB100.A14
AD15
  Top 0.305: PCB100.A15 120.33,76.2 121.6,77.47 J7.3
COPPER
  pour Top: 0,97.47 0,2.54 arc90 2.54,0 127.32,0 arc90 129.86,2.54 129.86,3.97 129.86,97.47 arc90 127.32,100.01 126.21,100.01 2.54,100.01 arc90
  pour Bottom (no thermals): 0,2.86 0,2.54 arc90 2.54,0 4.45,0 127.32,0 arc90 129.86,2.54 129.86,97.47 arc90 127.32,100.01 2.54,100.01 arc90 0,97.47 0,96.52
DA1
  Bottom 0.305: PCB100.42 117.16,57.15 120.97,57.15 121.6,57.78 121.6,69.22 120.97,69.85 116.52,69.85 115.89,70.48 115.89,71.75 117.79,73.66 117.79,83.5 116.52,84.77 75.56,84.77 71.25,89.09 71.7,90.17 75.56,90.17 76.52,89.22 X1.5
DA2
  Top 0.305: PCB100.48 108.27,72.39 108.27,78.42 107,79.69 93.66,79.69 92.39,80.96 92.39,88.74 92.04,89.1 X2.5
DA3
  Top 0.305: X3.5 107.39,89.14 107.63,88.9 107.63,80.96 111.13,77.47 112.71,77.47 113.35,76.83 113.35,69.85 PCB100.50
DA4
  Top 0.305: PCB100.52 118.43,69.85 118.43,73.34 125.41,80.33 125.41,92.23 124.78,92.87 123.14,92.87 122.51,92.23 X4.5
DB1  (via drill 0.35)
  Top 0.305: v105.73,73.03 116.52,62.23 118.43,62.23 PCB100.47
  Bottom 0.305: J4.1 83.5,79.69 104.46,79.69 105.73,78.42 v105.73,73.03
DB2
  Bottom 0.305: J5.1 97.47,80.96 109.54,80.96 110.17,81.6 110.17,82.87 110.81,83.5 113.35,83.5 117.16,79.69 117.16,73.98 115.25,72.07 115.25,68.58 116.52,67.31 120.33,67.31 120.97,66.67 120.97,64.77 PCB100.49
DB3
  Bottom 0.305: PCB100.51 118.43,64.77 115.89,64.77 114.62,66.04 114.62,72.39 116.52,74.3 116.52,79.38 113.66,82.23 J6.1
DB4
  Top 0.305: PCB100.53 120.97,69.85 120.97,74.93 123.27,77.23 126.68,80.64 J7.1
GND  (via drill 0.35)
  Top 0.305: J13.GND 18.34,7.62 7.3,7.62 2.76,12.16 LED1.C
  Top 0.508: PCB100.GND 49.59,26.1 J8.1 40.39,16.89 40.32,16.89 | X5.2 40.32,16.89 | J1.1 53.02,95.57 S1.1 61.98,96.52 69.85,96.52 73.71,92.66 X1.2 | X4.3 120.47,90.64 X4.2 | X3.3 105.23,90.64 X3.2 | X2.3 89.99,90.64 X2.2 | X1.3 74.75,90.64 X1.2 | J10.1 40.32,9.53 40.32,16.89 | X1.2 69.14,91.68 66.36,88.9 PCB100.GND.
  Top 1.27: v27.62,62.55 68.58,62.55 69.85,61.28 v69.85,53.02 69.85,44.2 C1.2 72.14,41.91 91.82,41.91 C2.2 94.3,44.38 v94.3,53.02
  Top 2.032: U$1.IN- 17.84,56.39 10.48,63.75 10.48,88.27 18.22,96.01 U$1.OUT-
  Bottom 0.508: J10.1 J10.2 J10.3 J10.4 J10.5 J10.6 J10.7 J10.8 J10.9 J10.10 J10.11 69.53,8.89 72.71,12.06 75.72,12.06 | J1.1 J1.2 J1.3 J1.4 J1.5 J1.6 J1.7 J1.8 J1.9 J1.10 J1.11 J1.12 19.3,96.2 U$1.OUT- | JP1.17 JP1.18 124.78,71.12 | 124.78,71.12 PCB100.GND.... PCB100.GND... | X9.3 120.28,12.06 106.36,12.06 | 91.12,12.06 75.72,12.06 | 106.36,12.06 91.12,12.06 | 106.36,12.06 106.23,11.93 X8.3 | 91.12,12.06 90.99,11.93 X7.3 | R103.1 62.28,54.39 C103.2 C101.2 62.18,50.16 62.82,49.53 65.98,49.53 66.61,50.16 U$101.11 v69.85,53.02 | X1.3 75.94,87.95 89.85,87.95 | 89.85,87.95 105.09,87.95 | 105.09,87.95 119.28,87.95 X4.3 121.81,90.49 127.64,90.49 128.91,89.22 128.91,72.39 127.64,71.12 124.78,71.12 | 89.85,87.95 89.99,88.08 X2.3 | 105.09,87.95 105.23,88.08 X3.3 | R102.1 86.41,54.39 C102.2 C100.2 86.31,50.53 87.31,49.53 89.85,49.53 90.74,50.42 U$100.11 93.98,53.02 | 97.47,53.02 U$100.PAD 97.47,64.45 | v69.85,53.02 73.34,53.02 | 73.34,53.02 U$101.PAD 73.34,64.45 | R101.1 83.82,55.51 83.82,54.29 82.55,53.02 U$101.10 73.34,53.02 | R100.1 107.95,55.51 107.95,54.29 106.68,53.02 U$100.10 97.47,53.02 | U$101.1 73.34,64.45 | U$101.20 69.85,64.45 | 69.85,64.45 73.34,64.45 | U$100.20 93.98,64.45 | 93.98,64.45 97.47,64.45 | U$100.1 97.47,64.45 | X6.3 75.75,12.04 75.72,12.06 | 69.85,64.45 v69.85,53.02 | 93.98,64.45 93.98,53.02 | J8.1 48.9,21.59 84.45,21.59 86.36,23.5 J9.1 | 93.98,53.02 v94.3,53.02 97.47,53.02
  Bottom 1.27: U$1.IN- 25.27,62.55 v27.62,62.55
  Bottom 2.032: J13.GND 20.12,7.7 J13.GNDBREAK 28.07,10.7 X5.2 19.11,32.04 U$1.IN- | PCB100.GND. PCB100.GND..
IO0
  Top 0.305: JP1.3 126.05,19.05 121.6,19.05 120.97,19.68 120.97,38.73 120.33,39.37 118.43,39.37 PCB100.30
IO1
  Top 0.305: JP1.4 122.24,20.32 121.6,20.95 121.6,40.01 120.97,40.64 PCB100.31
IO2
  Top 0.305: PCB100.32 118.43,41.91 121.6,41.91 122.24,41.27 122.24,22.23 122.87,21.59 126.05,21.59 JP1.5
IO3
  Top 0.305: JP1.6 123.51,22.86 122.87,23.5 122.87,42.55 122.24,43.18 PCB100.33
IO4
  Top 0.305: PCB100.34 118.43,44.45 122.87,44.45 123.51,43.81 123.51,24.77 124.14,24.13 126.05,24.13 JP1.7
IO5
  Bottom 0.305: JP1.8 121.6,25.4 120.97,26.04 120.97,45.09 120.33,45.72 PCB100.35
IO6
  Bottom 0.305: JP1.9 126.05,26.67 122.24,26.67 121.6,27.3 121.6,46.35 120.97,46.99 118.43,46.99 PCB100.36
IO7
  Bottom 0.305: PCB100.37 121.6,48.26 122.24,47.62 122.24,28.57 122.87,27.94 JP1.10
IO8
  Bottom 0.305: JP1.11 126.05,29.21 123.51,29.21 122.87,29.84 122.87,48.9 122.24,49.53 118.43,49.53 PCB100.38
IO9
  Bottom 0.305: PCB100.39 122.87,50.8 123.51,50.16 123.51,31.11 124.14,30.48 JP1.12
IO10  (via drill 0.35)
  Top 0.305: JP1.13 129.22,34.92 v129.22,54.61 | PCB100.40 118.43,54.61 v127.95,54.61
  Bottom 0.305: v127.95,54.61 v129.22,54.61
IO11
  Top 0.305: JP1.14 126.05,34.29 126.05,52.7 125.41,53.34 PCB100.41
IO12
  Top 0.305: JP1.15 128.59,36.83 128.59,55.24 127.95,55.88 PCB100.43
M1_DIR  (via drill 0.35)
  Top 0.305: v107,54.61 107,50.48 105.73,49.21 105.73,44.13 115.57,34.29 117.79,34.29 118.43,33.66 118.43,31.75 PCB100.23
  Bottom 0.305: v107,54.61 107,56.2 106.36,56.83 U$100.7
M1_EN  (via drill 0.35)
  Top 0.305: v105.73,53.98 105.73,50.16 105.09,49.53 105.09,43.81 115.25,33.66 115.25,32.07 116.84,30.48 PCB100.22
  Bottom 0.305: 105.73,55.56 U$100.8 | v105.73,53.98 105.73,55.56 | 105.73,55.56 R100.2
M1_OUTA  (via drill 0.35)
  Top 0.508: v102.08,60.64 102.08,46.83 103.5,45.4 v103.5,43.18 | X9.1 v123.51,15.56
  Bottom 0.508: U$100.4 v102.08,60.64 | v103.5,43.18 103.5,43.02 110.97,35.56 110.97,23.79 110.31,23.13 110.31,16.83 111.58,15.56 v123.51,15.56
M1_OUTB  (via drill 0.35)
  Top 0.508: v102.87,59.37 102.87,47.31 104.46,45.72 104.46,43.18 v104.5,43.22 | X9.2 124.78,10.6 v124.78,16.51
  Bottom 0.508: U$100.5 v102.87,59.37 | v104.5,43.22 111.92,35.8 111.92,23.5 111.13,22.7 111.13,17.78 112.39,16.51 v124.78,16.51
M1_SPD  (via drill 0.35)
  Top 0.305: PCB100.2 84.14,30.48 96.52,30.48 98.58,32.54 v98.58,46.04
  Bottom 0.305: U$100.9 103.19,54.29 102.55,54.93 102.55,56.83 103.19,57.47 108.27,57.47 108.9,56.83 108.9,50.48 104.46,46.04 v98.58,46.04
M1_TACH1
  Top 0.305: PCB100.21 109.54,18.41 110.97,16.99 110.97,11.59 111.6,10.95 119.35,10.95 X9.5
M1_TACH2  (via drill 0.35)
  Top 0.305: v109.54,17.46 110.33,16.67 110.33,8.89 110.97,8.26 118.35,8.26 X9.6
  Bottom 0.305: PCB100.17 99.38,18.89 100.81,17.46 v109.54,17.46
M2_DIR  (via drill 0.35)
  Top 0.305: v89.22,45.4 v89.22,55.56
  Bottom 0.305: v89.22,55.56 U$100.13 | v89.22,45.4 89.85,44.77 105.09,44.77 115.57,34.29 119.06,34.29 119.7,33.66 PCB100.25
M2_EN  (via drill 0.35)
  Top 0.305: v88.27,45.4 v88.27,55.56
  Bottom 0.305: U$100.14 89.53,56.83 | 89.53,56.83 88.9,57.47 R102.2 | v88.27,55.56 89.53,56.83 | v88.27,45.4 89.53,44.13 104.78,44.13 115.89,33.02 PCB100.24
M2_OUTA  (via drill 0.35)
  Top 0.508: v90.49,43.5 90.49,45.72 92.08,47.31 v92.08,59.37 | v108.27,15.56 X8.1
  Bottom 0.508: U$100.16 v92.08,59.37 | v90.49,43.5 90.49,30.46 89.59,29.57 89.59,26.3 100.33,15.56 v108.27,15.56
M2_OUTB  (via drill 0.35)
  Top 0.508: v91.44,43.5 91.44,45.4 93.03,46.99 v93.03,60.64 | v109.54,16.51 109.54,10.6 X8.2
  Bottom 0.508: U$100.17 v93.03,60.64 | v91.44,43.5 91.44,30.16 90.25,28.98 90.25,26.91 100.65,16.51 v109.54,16.51
M2_SPD  (via drill 0.35)
  Top 0.305: v89.22,58.1 87.47,56.36 87.47,53.66 86.94,53.13 v84.66,53.13
  Bottom 0.305: v89.22,58.1 U$100.15 | PCB100.3 78.74,28.26 78.74,47.21 v84.66,53.13
M2_TACH1
  Top 0.305: X8.5 103.82,11.24 103.82,25.4 106.36,27.94 PCB100.20
M2_TACH2
  Top 0.305: X8.6 103.19,25.4 102.55,26.04 97.47,26.04 96.84,26.67 PCB100.16
M3_DIR  (via drill 0.35)
  Top 0.305: v81.6,56.83 83.19,56.83 v88.58,62.23
  Bottom 0.305: v81.6,56.83 U$101.7 | v88.58,62.23 88.58,66.04 89.85,67.31 112.08,67.31 113.35,66.04 113.35,38.26 114.78,36.83 119.06,36.83 119.7,36.2 PCB100.27
M3_EN
  Bottom 0.305: U$101.8 R101.2 82.23,55.56 82.23,56.83 82.87,57.47 84.77,57.47 85.41,56.83 85.41,50.16 90.17,45.4 105.41,45.4 115.25,35.56 PCB100.26
M3_OUTA  (via drill 0.35)
  Top 0.508: v77.95,60.64 77.95,46.83 79.38,45.4 v79.38,43.5 | X7.1 v93.03,15.56
  Bottom 0.508: U$101.4 v77.95,60.64 | v93.03,15.56 93.03,20.32 88.11,25.24 88.11,29.05 79.38,37.78 v79.38,43.5
M3_OUTB  (via drill 0.35)
  Top 0.508: v78.74,59.37 78.74,47.31 80.33,45.72 v80.33,43.5 | X7.2 94.3,10.6 v94.3,16.51
  Bottom 0.508: U$101.5 v78.74,59.37 | v80.33,43.5 80.33,38.1 88.9,29.53 88.9,25.72 94.3,20.32 v94.3,16.51
M3_SPD
  Bottom 0.305: U$101.9 82.23,54.29 82.87,54.93 82.87,56.2 83.5,56.83 84.14,56.83 84.77,56.2 84.77,54.13 78.1,47.47 78.1,29.53 PCB100.4
M3_TACH1
  Top 0.305: PCB100.19 103.19,26.67 98.74,26.67 98.11,27.3 98.11,28.57 97.47,29.21 96.2,29.21 95.57,28.57 95.57,27.3 89.22,20.95 89.22,11.11 X7.5
M3_TACH2
  Top 0.305: X7.6 87.95,20.95 94.3,27.3 PCB100.15
M4_DIR  (via drill 0.35)
  Top 0.305: v88.27,60.96 v85.41,58.1
  Bottom 0.305: 67.95,55.56 67.95,58.42 67.63,58.74 65.41,58.74 65.41,65.09 67.63,67.31 84.45,67.31 85.73,66.04 85.73,58.42 v85.41,58.1 | v88.27,60.96 87.95,61.28 87.95,66.67 89.22,67.94 112.71,67.94 113.98,66.67 113.98,40.64 115.25,39.37 119.06,39.37 119.7,38.73 PCB100.29
  Bottom 0.508: U$101.13 67.95,55.56
M4_EN  (via drill 0.35)
  Top 0.305: v99.69,52.07 99.69,61.59 98.42,62.87 v86.36,62.87 | PCB100.28 112.71,38.1 106.36,44.45 v106.36,48.9
  Bottom 0.305: U$101.14 65.41,56.83 64.77,57.47 64.45,57.47 | 64.45,57.47 64.45,65.09 67.31,67.94 85.09,67.94 86.36,66.67 v86.36,62.87 | v106.36,48.9 106.36,51.44 105.73,52.07 v99.69,52.07 | 64.45,57.47 R103.2
M4_OUTA  (via drill 0.35)
  Top 0.508: v67.95,59.37 67.95,47.31 66.36,45.72 v66.36,15.56 | X6.1 v77.79,15.56
  Bottom 0.508: U$101.16 v67.95,59.37 | v77.79,15.56 v66.36,15.56
M4_OUTB  (via drill 0.35)
  Top 0.508: v68.74,60.64 68.74,46.83 67.31,45.4 v67.31,16.51 | X6.2 79.06,10.6 v79.06,16.51
  Bottom 0.508: U$101.17 v68.74,60.64 | v79.06,16.51 v67.31,16.51
M4_SPD  (via drill 0.35)
  Top 0.305: v65.09,47.31 v65.09,58.1
  Bottom 0.305: v65.09,58.1 U$101.15 | v65.09,47.31 66.99,45.4 66.99,30.48 68.26,29.21 72.71,29.21 PCB100.5
M4_TACH1
  Top 0.305: PCB100.18 100.01,29.84 91.76,29.84 90.49,28.57 90.49,25.4 86.6,21.51 86.6,9.68 85.33,8.41 78.37,8.41 77.1,7.14 74.34,7.14 73.71,7.78 X6.5
M4_TACH2
  Top 0.305: PCB100.14 91.76,25.72 87.31,21.27 87.31,9.21 85.88,7.78 78.74,7.78 77.47,6.51 73.98,6.51 72.71,7.78 X6.6
N$19
  Bottom 2.032: PCB100.VIN 68.9,78.23 PTC100.1
N$97
  Top 0.305: R1.2 9.79,9.29 S2.3
  Bottom 2.032: S2.3 1.84,16.36 U$1.IN+
N$98
  Top 0.305: R1.1 LED1.A
N$100
  Bottom 2.032: X5.1 21.61,16.89 J13.PWR 11.07,6.35 S2.2
PWM0
  Top 0.305: PCB100.6 71.44,15.24 66.36,10.16 66.36,7.62 J11.11
PWM1
  Top 0.305: PCB100.7 68.9,15.24 63.82,10.16 63.82,7.62 J11.10
PWM2
  Top 0.305: J11.9 61.28,7.62 61.28,10.16 64.83,13.72 PCB100.8
PWM3
  Top 0.305: J11.8 58.74,7.62 58.74,10.16 62.29,13.72 PCB100.9
PWM4
  Top 0.305: PCB100.10 59.75,13.72 56.2,10.16 56.2,7.62 J11.7
PWM5
  Top 0.305: J11.6 53.66,7.62 53.66,10.16 57.21,13.72 PCB100.11
PWM6
  Top 0.305: PCB100.12 54.67,13.72 51.12,10.16 51.12,7.62 J11.5
PWM7
  Top 0.305: J11.4 48.58,7.62 48.58,10.16 52.13,13.72 PCB100.13
PWM8
  Top 0.305: J11.3 43.5,5.08 43.5,1.91 42.23,0.64 27.48,0.64 26.21,1.91 26.21,12.36 24.45,14.12 24.45,65.41 25.72,66.67 110.81,66.67 116.52,60.96 PCB100.46
PWM9
  Top 0.305: J11.2 40.96,5.08 40.96,2.54 39.69,1.27 28.26,1.27 26.99,2.54 26.99,12.7 25.08,14.61 25.08,64.77 26.35,66.04 110.17,66.04 116.52,59.69 118.43,59.69 PCB100.45
PWM10
  Top 0.305: J11.1 38.42,5.08 38.42,3.17 37.15,1.91 28.89,1.91 27.62,3.17 27.62,13.34 25.72,15.24 25.72,64.14 26.99,65.41 109.54,65.41 116.52,58.42 PCB100.44
RESET
  Top 0.508: S1.3 60.07,91.76 56.2,87.88 PCB100.RESET
RX
  Top 0.305: J9.2 84.14,25.4 PCB100.0
S1-P1
  Top 0.305: J4.4 73.34,88.27 72.71,88.9 X1.1
S1-P6
  Top 0.305: J4.2 78.42,91.05 X1.6
S2-P1
  Top 0.305: J5.4 88.58,88.5 X2.1
S2-P6
  Top 0.305: X2.6 93.66,91.05 J5.2
S3-P1
  Top 0.305: X3.1 103.82,88.5 J6.4
S3-P6
  Top 0.305: X3.6 108.9,91.05 J6.2
S4-P1
  Top 0.305: X4.1 119.06,88.5 J7.4
S4-P6
  Top 0.305: J7.2 124.14,91.05 X4.6
SCL
  Top 0.305: PCB100.SCL1 41.97,23.56 J8.3
SDA
  Top 0.305: PCB100.SDA1 44.51,23.56 J8.2
TX
  Top 0.305: PCB100.1 81.6,25.4 J9.3
VMOTOR  (via drill 0.35)
  Top 1.27: v27.62,64.14 76.84,64.14 | 76.84,64.14 99.06,64.14 100.97,62.23 v100.97,58.1 100.97,44.2 C2.1 | C1.1 76.84,44.2 v76.84,58.1 76.84,64.14
  Bottom 0.508: J7.5 114.62,84.14 101.28,84.14 | 86.04,84.14 70.8,84.14 | 86.04,84.14 101.28,84.14 | J6.5 101.28,84.14 | J5.5 86.04,84.14 | J4.5 70.8,84.14 | v76.84,58.1 U$101.6 | U$100.6 v100.97,58.1 | 70.8,84.14 69.6,85.34 63.34,85.34 60.6,82.61 PTC100.2
  Bottom 1.27: 27.62,82.23 v27.62,64.14
  Bottom 2.032: PTC100.2 27.62,82.23 21.02,82.23 7.24,96.01 U$1.OUT+

### Text on the board
tPlace: LEGOduino Mega | REV: A | Design: L.E. Fdez